# EAGLE schematic UartWifiBoard (EAGLE 7.7.0)

## Sheet 1 of 2
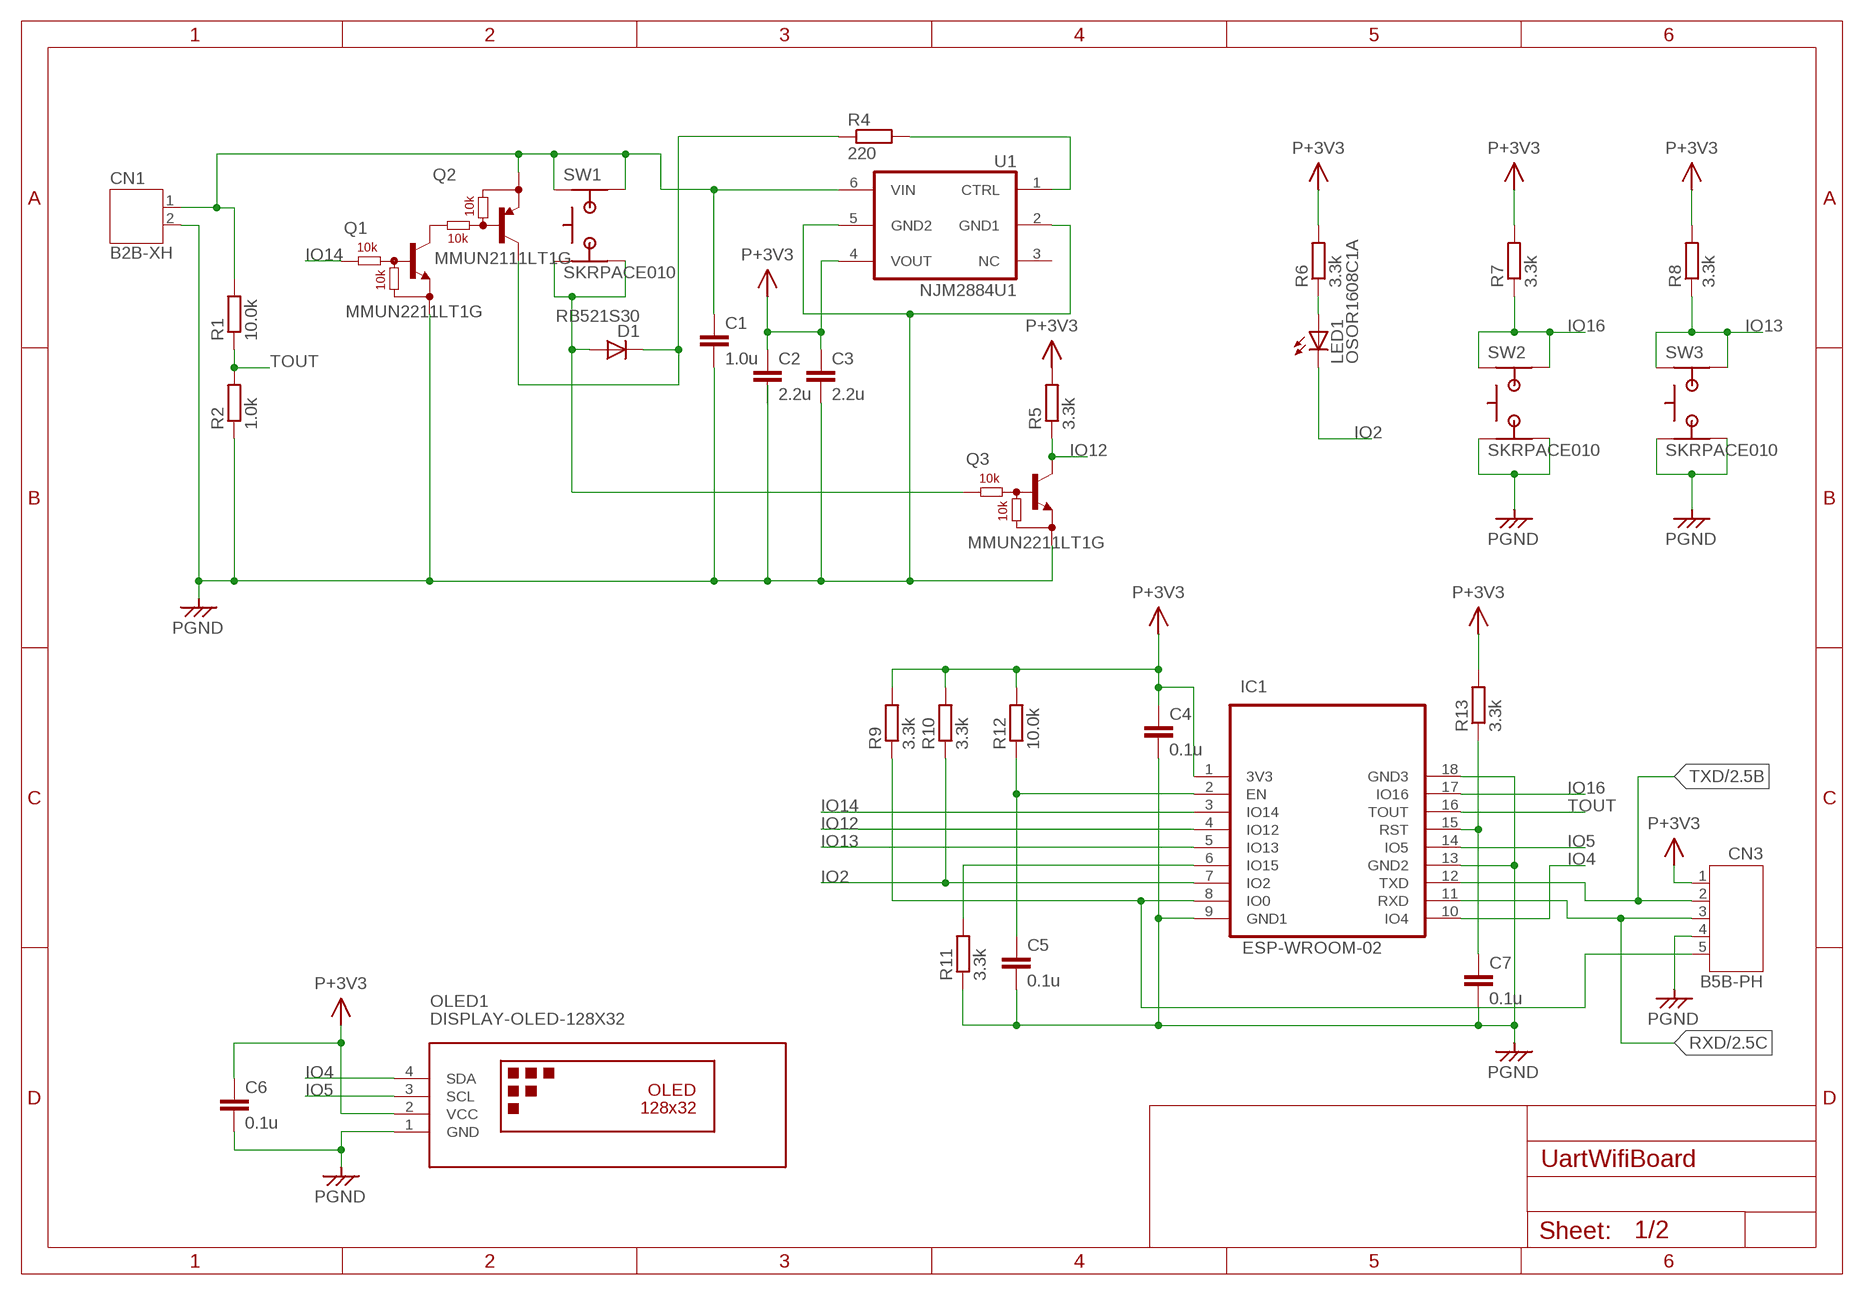
[diagram p0: schematic, sheet 1]

### Parts
C1  1.0u  C-EUC0603  [C0603]
C2  2.2u  C-EUC0603  [C0603]
C3  2.2u  C-EUC0603  [C0603]
C4  0.1u  C-EUC0603  [C0603]
C5  0.1u  C-EUC0603  [C0603]
C6  0.1u  C-EUC0603  [C0603]
C7  0.1u  C-EUC0603  [C0603]
CN1  B2B-XH  [B2B-XH]
CN3  B5B-PH  [B5B-PH]
D1  RB521S30  [SOD-523F]
IC1  ESP-WROOM-02  [ESP-WROOM-02]
LED1  OSOR1608C1A  [LED0603SMD]
OLED1  DISPLAY-OLED-128X32  [DISPLAY-OLED-128X32]
Q1  MMUN2211LT1G  [SOT-23]
Q2  MMUN2111LT1G  [SOT-23]
Q3  MMUN2211LT1G  [SOT-23]
R1  10.0k  R-EU_R0603  [R0603]
R2  1.0k  R-EU_R0603  [R0603]
R4  220  R-EU_R0603  [R0603]
R5  3.3k  R-EU_R0603  [R0603]
R6  3.3k  R-EU_R0603  [R0603]
R7  3.3k  R-EU_R0603  [R0603]
R8  3.3k  R-EU_R0603  [R0603]
R9  3.3k  R-EU_R0603  [R0603]
R10  3.3k  R-EU_R0603  [R0603]
R11  3.3k  R-EU_R0603  [R0603]
R12  10.0k  R-EU_R0603  [R0603]
R13  3.3k  R-EU_R0603  [R0603]
SW1  SKRPACE010  [SKRP]
SW2  SKRPACE010  [SKRP]
SW3  SKRPACE010  [SKRP]
U1  NJM2884U1  [SOT89-5]

### Nets
IO0: CN3.5 IC1.8(IO0) R9.1
IO2: IC1.7(IO2) LED1.C R10.1
IO4: IC1.10(IO4) OLED1.4(SDA)
IO5: IC1.14(IO5) OLED1.3(SCL)
IO12: IC1.4(IO12) Q3.P$3(C) R5.1
IO13: IC1.5(IO13) R8.1 SW3.1 SW3.2
IO14: IC1.3(IO14) Q1.P$1(B)
IO15: IC1.6(IO15) R11.2
IO16: IC1.17(IO16) R7.1 SW2.1 SW2.2
N$1: Q1.P$3(C) Q2.P$1(B)
N$2: R4.2 U1.1(CTRL)
N$3: C1.1 CN1.1 Q2.P$2(E) R1.2 SW1.1 SW1.2 U1.6(VIN)
N$5: D1.C Q2.P$3(C) R4.1
N$14: D1.A Q3.P$1(B) SW1.3 SW1.4
N$19: C5.1 IC1.2(EN) R12.1
N$22: LED1.A R6.1
P+3V3: C2.1 C3.1 C4.1 C6.1 CN3.1 IC1.1(3V3) OLED1.2(VCC) R5.2 R6.2 R7.2 R8.2 R9.2 R10.2 R12.2 R13.2 U1.4(VOUT) ; also sheet 2
PGND: C1.2 C2.2 C3.2 C4.2 C5.2 C6.2 C7.2 CN1.2 CN3.4 IC1.9(GND1) IC1.13(GND2) IC1.18(GND3) OLED1.1(GND) Q1.P$2(E) Q3.P$2(E) R2.1 R11.1 SW2.3 SW2.4 SW3.3 SW3.4 U1.2(GND1) U1.5(GND2) ; also sheet 2
RST: C7.1 IC1.15(RST) R13.1
RXD: CN3.3 IC1.11(RXD) ; also sheet 2
TOUT: IC1.16(TOUT) R1.1 R2.2
TXD: CN3.2 IC1.12(TXD) ; also sheet 2
Unconnected: U1.3(NC)

## Sheet 2 of 2
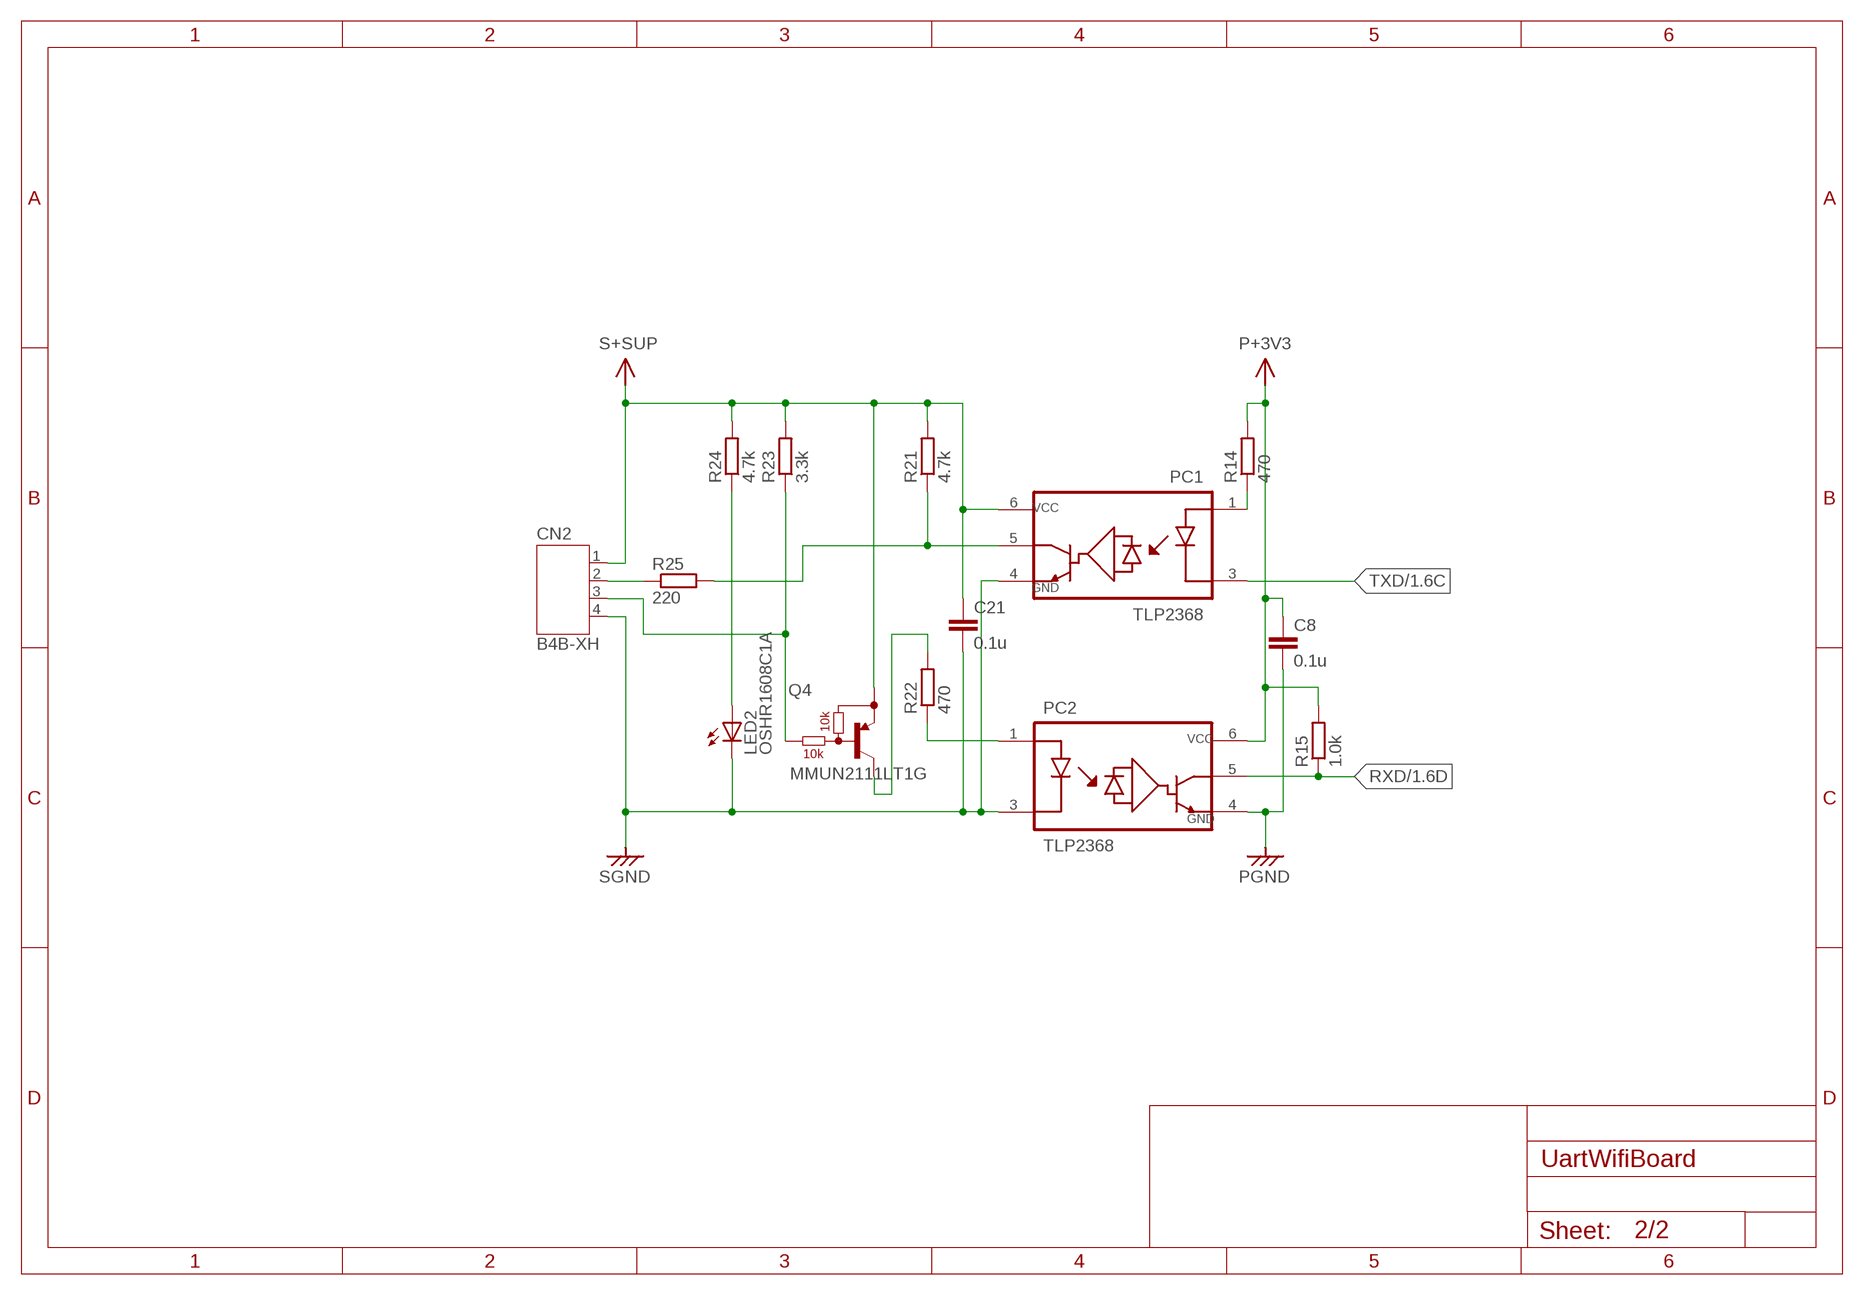
[diagram p1: schematic, sheet 2]

### Parts
C8  0.1u  C-EUC0603  [C0603]
C21  0.1u  C-EUC0603  [C0603]
CN2  B4B-XH  [B4B-XH]
LED2  OSHR1608C1A  [LED0603SMD]
PC1  TLP2368  [SO6-5PIN]
PC2  TLP2368  [SO6-5PIN]
Q4  MMUN2111LT1G  [SOT-23]
R14  470  R-EU_R0603  [R0603]
R15  1.0k  R-EU_R0603  [R0603]
R21  4.7k  R-EU_R0603  [R0603]
R22  470  R-EU_R0603  [R0603]
R23  3.3k  R-EU_R0603  [R0603]
R24  4.7k  R-EU_R0603  [R0603]
R25  220  R-EU_R0603  [R0603]

### Nets
N$4: Q4.P$3(C) R22.2
N$7: CN2.3 Q4.P$1(B) R23.1
N$8: PC2.1(A) R22.1
N$11: PC1.5(VO) R21.1 R25.2
N$12: CN2.2 R25.1
N$13: LED2.A R24.1
N$16: PC1.1(A) R14.1
P+3V3: C8.1 PC2.6(VCC) R14.2 R15.2 ; also sheet 1
PGND: C8.2 PC2.4(GND) ; also sheet 1
RXD: PC2.5(VO) R15.1 ; also sheet 1
S+SUP: C21.1 CN2.1 PC1.6(VCC) Q4.P$2(E) R21.2 R23.2 R24.2
SGND: C21.2 CN2.4 LED2.C PC1.4(GND) PC2.3(K)
TXD: PC1.3(K) ; also sheet 1

## Library data of the parts
C1-C8 C21 = rcl:C-EU: CAPACITOR, European symbol
CN1 = jst:B2B-XH
CN2 = jst:B4B-XH
CN3 = jst:B5B-PH
D1 = on-semiconductor:RB521S30
IC1 = espressif:ESP-WROOM-02: WiFi module - ESP-WROOM-02
LED1 = optosupply:OSOR1608C1A: Orange OR λD(nm):610
LED2 = optosupply:OSHR1608C1A: Red HR λD(nm):625
OLED1 = generic-brand-oled-modules:DISPLAY-OLED-128X32: 128x32 Dot Matrix OLED Module with I2C interface based on SSD1306 chip
PC1 PC2 = toshiba:TLP2368
Q1 Q3 = on-semiconductor:MMUN2211LT1G
Q2 Q4 = on-semiconductor:MMUN2111LT1G
R1 R2 R4-R15 R21-R25 = rcl:R-EU_: RESISTOR, European symbol
SW1-SW3 = alps:SKRPACE010
U1 = njrc:NJM2884U1